# EAGLE design IDEAdapterSingle (EAGLE 6.6.0)
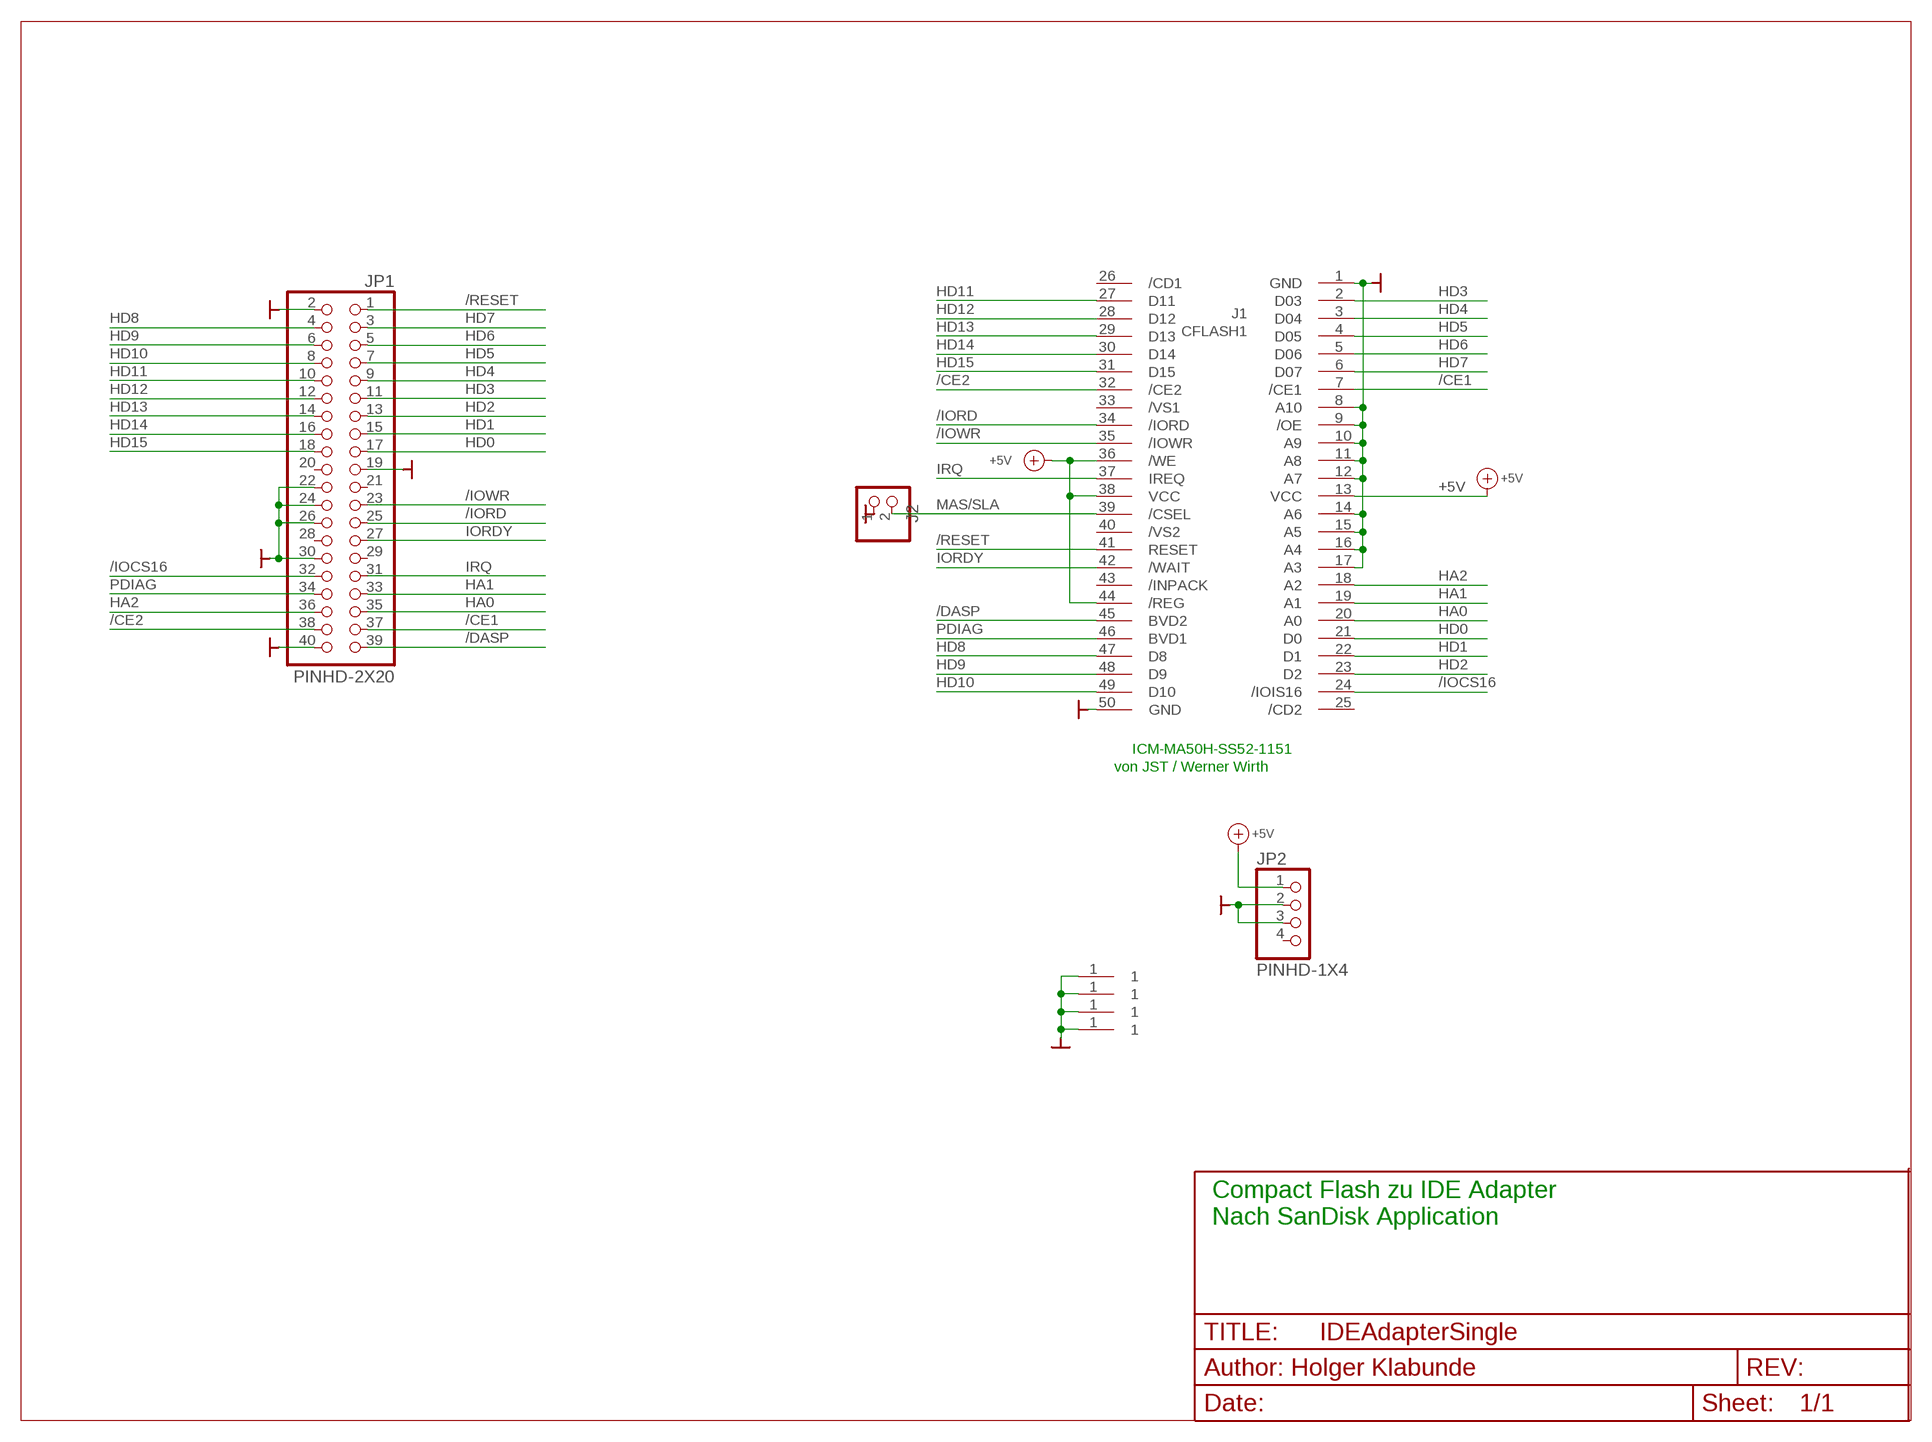
[diagram p0: schematic, sheet 1]

## Parts
J1  CFLASH1  [CFSMT]
J2  JUMPER  PINHD-1X2  [1X02]
JP1  PINHD-2X20  [2X20]
JP2  PINHD-1X4  [1X04]
U$13  BOHRUNG  [BOHRUNG]
U$14  BOHRUNG  [BOHRUNG]
U$16  BOHRUNG  [BOHRUNG]
U$17  BOHRUNG  [BOHRUNG]

## Nets
+5V: J1.13(VCC) J1.36(/WE) J1.38(VCC) J1.44(/REG) JP2.1
/CE1: J1.7(/CE1) JP1.37
/CE2: J1.32(/CE2) JP1.38
/DASP: J1.45(BVD2) JP1.39
/IOCS16: J1.24(/IOIS16) JP1.32
/IORD: J1.34(/IORD) JP1.25
/IOWR: J1.35(/IOWR) JP1.23
/RESET: J1.41(RESET) JP1.1
GND: J1.1(GND) J1.8(A10) J1.9(/OE) J1.10(A9) J1.11(A8) J1.12(A7) J1.14(A6) J1.15(A5) J1.16(A4) J1.17(A3) J1.50(GND) J2.1 JP1.2 JP1.19 JP1.22 JP1.24 JP1.26 JP1.30 JP1.40 JP2.2 JP2.3 U$13.1 U$14.1 U$16.1 U$17.1
HA0: J1.20(A0) JP1.35
HA1: J1.19(A1) JP1.33
HA2: J1.18(A2) JP1.36
HD0: J1.21(D0) JP1.17
HD1: J1.22(D1) JP1.15
HD2: J1.23(D2) JP1.13
HD3: J1.2(D03) JP1.11
HD4: J1.3(D04) JP1.9
HD5: J1.4(D05) JP1.7
HD6: J1.5(D06) JP1.5
HD7: J1.6(D07) JP1.3
HD8: J1.47(D8) JP1.4
HD9: J1.48(D9) JP1.6
HD10: J1.49(D10) JP1.8
HD11: J1.27(D11) JP1.10
HD12: J1.28(D12) JP1.12
HD13: J1.29(D13) JP1.14
HD14: J1.30(D14) JP1.16
HD15: J1.31(D15) JP1.18
IORDY: J1.42(/WAIT) JP1.27
IRQ: J1.37(IREQ) JP1.31
MAS/SLA: J1.39(/CSEL) J2.2
PDIAG: J1.46(BVD1) JP1.34
Unconnected: J1.25(/CD2) J1.26(/CD1) J1.33(/VS1) J1.40(/VS2) J1.43(/INPACK) JP1.20 JP1.21 JP1.28 JP1.29 JP2.4

## Notes on the sheet
- ICM-MA50H-SS52-1151
- von JST / Werner Wirth
- Compact Flash zu IDE Adapter
- Nach SanDisk Application

## Library data of the parts
J1 = IDEAdapterDouble:CFLASH1
J2 = pinhead:PINHD-1X2: PIN HEADER
JP1 = pinhead:PINHD-2X20: PIN HEADER
JP2 = pinhead:PINHD-1X4: PIN HEADER
U$13 U$14 U$16 U$17 = holgnorm:BOHRUNG

## Board
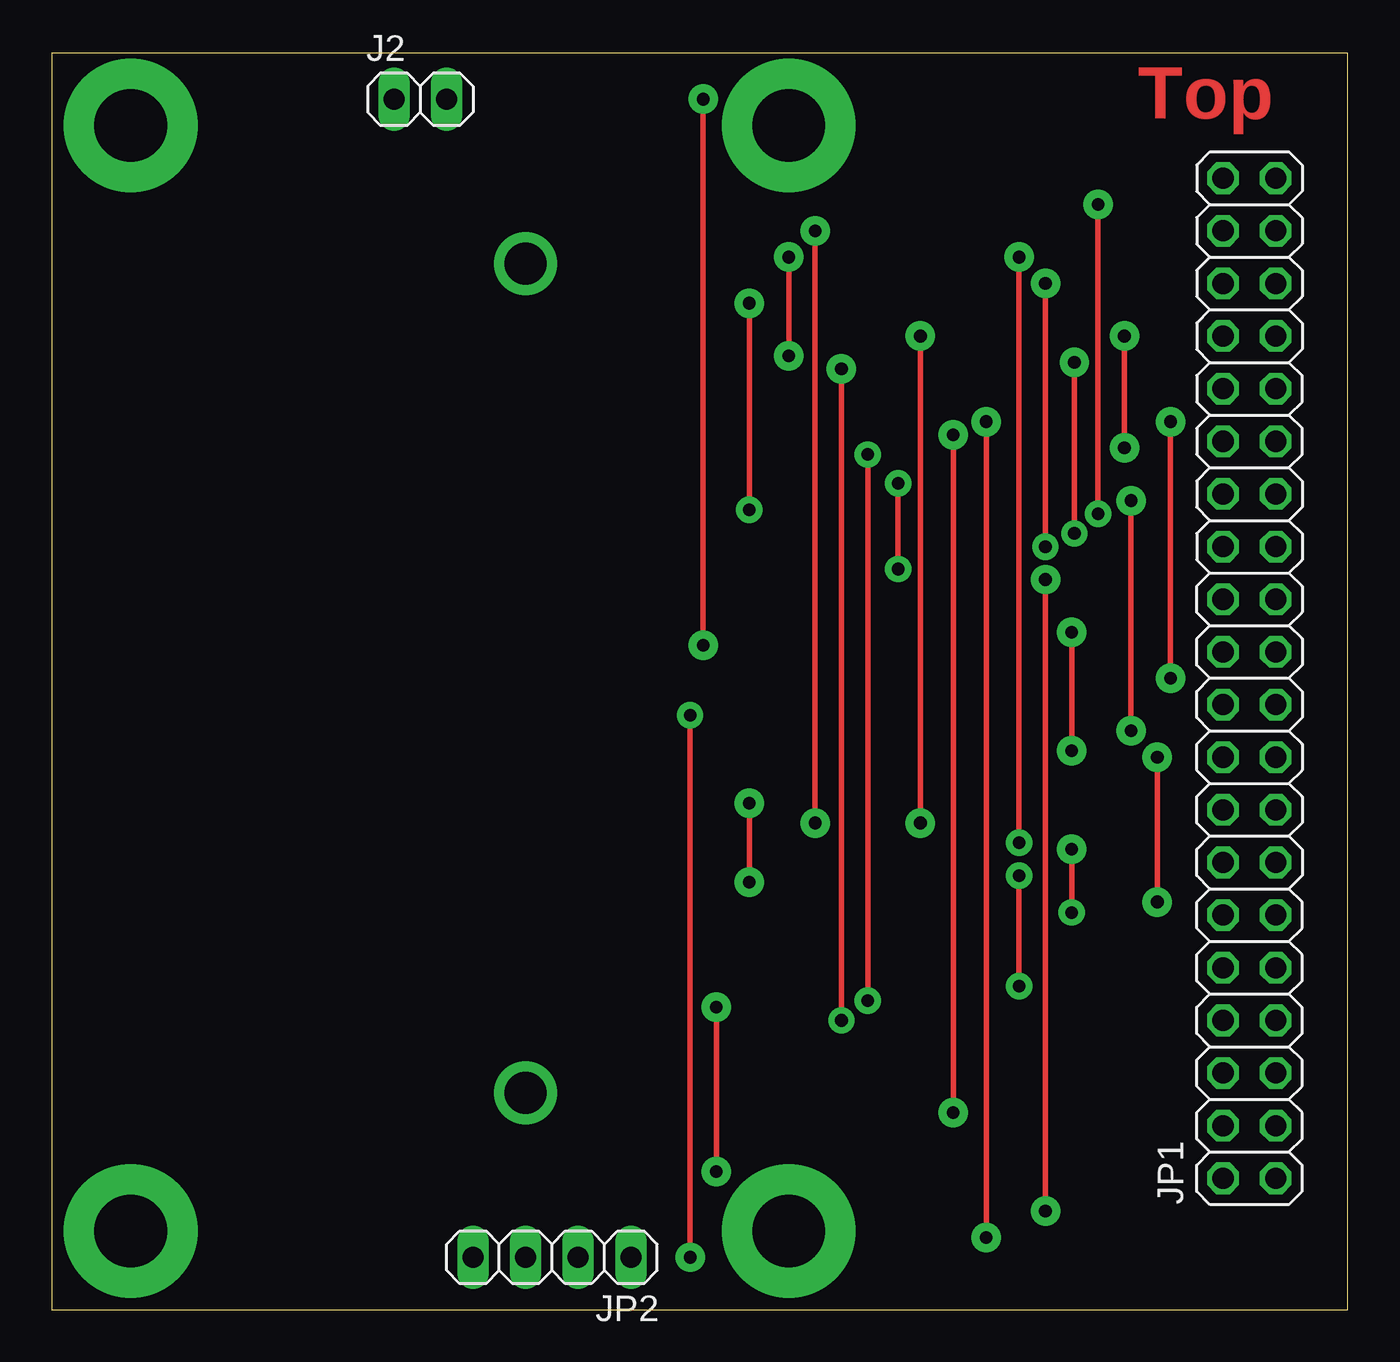
[diagram p1: board, top side]
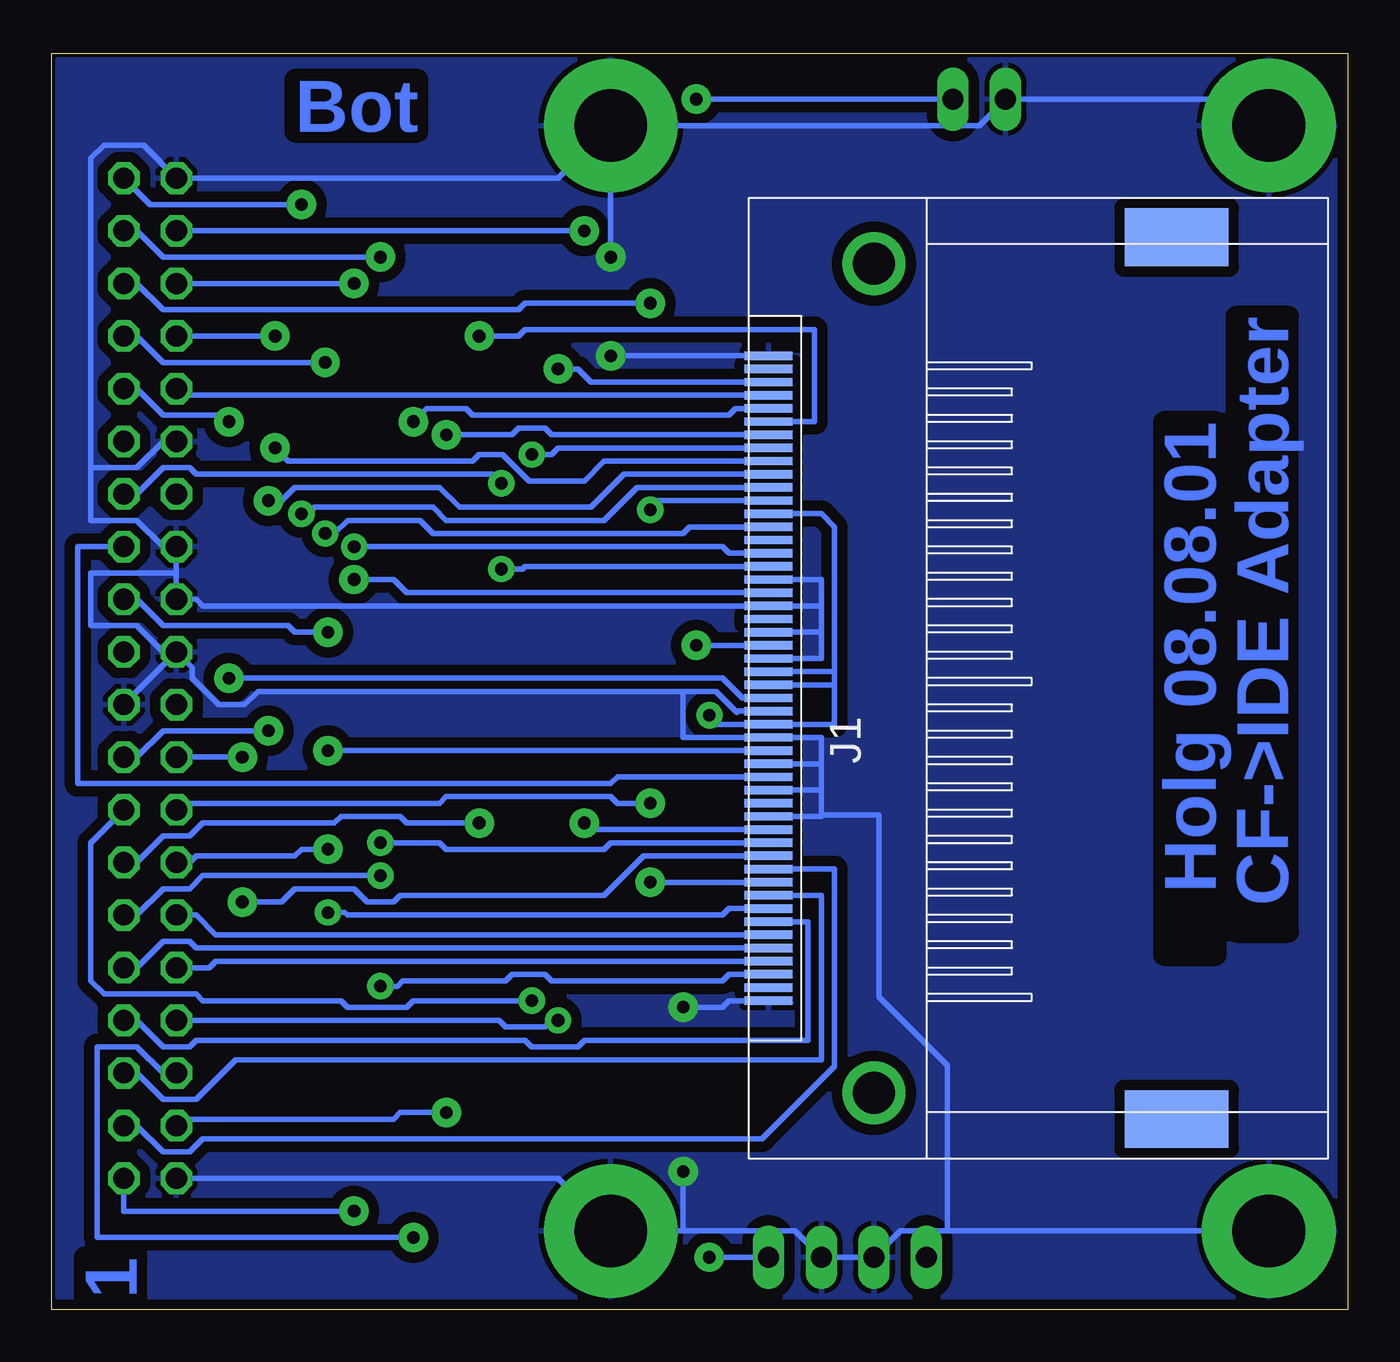
[diagram p2: board, bottom side, seen from below]

Size 62.53 x 60.63 mm. Coordinates in mm from the lower left corner, seen from the top.
Outline: 0,0 62.53,0 62.53,60.63 0,60.63 0,0
Copper layers (1*16): Top 0.035mm / dielectric 1.5mm / Bottom 0.035mm
Design rules "default *": minimum track width 10mil, minimum drill 24mil, track to track 8mil, track to pad 8mil, pad to pad 8mil, via to via 8mil, smd to smd 8mil, copper to edge 0mil, drill to drill 8mil, minimum pad ring 10mil, minimum via ring 8mil, stop-mask expansion 4mil, vias tented up to drill 0mil, thermal gap 10mil

### Footprints (pad centres in the part's own frame; a part is rotated, then mirrored left to right if it is on the bottom)
CFSMT = smd 0.406 x 2.311: 1 -15.557,0; 2 -14.287,0; 3 -13.018,0; 4 -11.748,0; 5 -10.477,0; 6 -9.207,0; 7 -7.938,0; 8 -6.668,0; 9 -5.397,0; 10 -4.128,0; 11 -2.857,0; 12 -1.587,0; 13 -0.318,0; 14 0.953,0; 15 2.223,0; 16 3.493,0; 17 4.763,0; 18 6.032,0; 19 7.303,0; 20 8.572,0; 21 9.842,0; 22 11.113,0; 23 12.383,0; 24 13.652,0; 25 14.922,0; 26 -14.922,0; 27 -13.652,0; 28 -12.383,0; 29 -11.113,0; 30 -9.842,0; 31 -8.572,0; 32 -7.303,0; 33 -6.032,0; 34 -4.763,0; 35 -3.493,0; 36 -2.223,0; 37 -0.953,0; 38 0.318,0; 39 1.587,0; 40 2.857,0; 41 4.128,0; 42 5.397,0; 43 6.668,0; 44 7.938,0; 45 9.207,0; 46 10.477,0; 47 11.748,0; 48 13.018,0; 49 14.287,0; 50 15.557,0 | drill 2.032 pad 3.048: GND@1 -20.003,-5.08; GND@2 20.003,-5.08 | smd 2.794 x 5.004: GND@3 -21.273,-19.685; GND@4 21.273,-19.685
1X02 = drill 1.016 long: 1 -1.27,0; 2 1.27,0
2X20 = drill 1.016 octagon: 1 -24.13,-1.27; 2 -24.13,1.27; 3 -21.59,-1.27; 4 -21.59,1.27; 5 -19.05,-1.27; 6 -19.05,1.27; 7 -16.51,-1.27; 8 -16.51,1.27; 9 -13.97,-1.27; 10 -13.97,1.27; 11 -11.43,-1.27; 12 -11.43,1.27; 13 -8.89,-1.27; 14 -8.89,1.27; 15 -6.35,-1.27; 16 -6.35,1.27; 17 -3.81,-1.27; 18 -3.81,1.27; 19 -1.27,-1.27; 20 -1.27,1.27; 21 1.27,-1.27; 22 1.27,1.27; 23 3.81,-1.27; 24 3.81,1.27; 25 6.35,-1.27; 26 6.35,1.27; 27 8.89,-1.27; 28 8.89,1.27; 29 11.43,-1.27; 30 11.43,1.27; 31 13.97,-1.27; 32 13.97,1.27; 33 16.51,-1.27; 34 16.51,1.27; 35 19.05,-1.27; 36 19.05,1.27; 37 21.59,-1.27; 38 21.59,1.27; 39 24.13,-1.27; 40 24.13,1.27
1X04 = drill 1.016 long: 1 -3.81,0; 2 -1.27,0; 3 1.27,0; 4 3.81,0
BOHRUNG = drill 3.505 pad 6.452: 1 0,0

### Placement (x,y rotation side)
J1  27.94,30.48 90 bottom
J2  17.78,58.42 0 top
JP1  57.78,30.48 90 top
JP2  24.13,2.54 180 top
U$13  3.81,3.81 0 top
U$14  3.81,57.15 0 top
U$16  35.56,57.15 0 top
U$17  35.56,3.81 0 top

### Tracks (layer width: path | path; a pad name or v marks a point on that pad's centre or on a via)
+5V  (via drill 0.61 pad 1.27, 0.61 pad 1.42)
  Top 0.254: v30.8,2.54 v30.8,28.7
  Bottom 0.254: 24.77,30.16 24.77,28.26 J1.36 30.48,28.26 30.48,28.32 30.8,28.64 v30.8,28.7 | 24.77,30.16 J1.13 | 24.77,30.16 24.77,30.8 | 24.77,30.8 J1.38 | 24.77,30.8 24.77,37.78 25.4,38.42 J1.44 | JP2.1 v30.8,2.54
/CE1  (via drill 0.61 pad 1.27, 0.61 pad 1.42)
  Top 0.254: v46.67,22.54 v46.67,50.8
  Bottom 0.254: v46.67,50.8 57.15,50.8 58.42,52.07 JP1.37 | J1.7 35.56,22.54 35.88,22.23 43.5,22.23 43.81,22.54 v46.67,22.54
/CE2  (via drill 0.61 pad 1.42)
  Top 0.254: v36.83,23.5 v36.83,52.07
  Bottom 0.254: v36.83,52.07 JP1.38 | v36.83,23.5 36.51,23.18 J1.32
/DASP  (via drill 0.61 pad 1.27, 0.61 pad 1.42)
  Top 0.254: v50.48,38.42 v50.48,53.34
  Bottom 0.254: v50.48,38.42 50.16,38.42 49.85,38.73 44.13,38.73 43.5,38.1 35.88,38.1 34.29,39.69 J1.45 | JP1.39 57.78,53.34 v50.48,53.34
/IOCS16
  Bottom 0.254: J1.24 55.88,44.13 56.2,44.45 JP1.32
/IORD
  Bottom 0.254: J1.34 35.24,25.72 35.56,25.4 61.28,25.4 61.28,36.83 JP1.25
/IOWR  (via drill 0.61 pad 1.42)
  Top 0.254: v49.21,26.99 v49.21,32.7
  Bottom 0.254: v49.21,32.7 50.8,32.7 51.12,33.02 57.15,33.02 58.42,34.29 JP1.23 | J1.35 v49.21,26.99
/RESET  (via drill 0.61 pad 1.42)
  Top 0.254: v47.94,4.76 v47.94,35.24
  Bottom 0.254: v47.94,35.24 46.04,35.24 45.4,34.61 J1.41 | v47.94,4.76 59.05,4.76 JP1.1
GND  (via drill 0.61 pad 1.42)
  Top 0.254: v32.07,6.67 v32.07,14.61 | v35.56,50.8 v35.56,46.04
  Bottom 0.254: JP1.2 38.1,6.35 U$17.1 32.07,3.81 | 25.4,25.08 J1.9 | 25.4,25.08 25.4,26.35 | 25.4,26.35 J1.10 | 25.4,26.35 25.4,27.62 J1.11 32.07,27.62 32.07,29.84 | v32.07,14.61 30.16,14.61 29.84,14.92 J1.1 | U$13.1 19.3,3.81 | 19.3,3.81 21.59,3.81 JP2.3 JP2.2 26.67,3.81 32.07,3.81 | 25.4,32.7 25.4,31.43 J1.14 | 25.4,32.7 J1.15 | 25.4,33.97 25.4,32.7 | 25.4,33.97 J1.16 55.24,33.97 55.56,34.29 JP1.24 | 25.4,33.97 25.4,35.24 J1.17 | JP1.22 JP1.19 | U$14.1 5.08,58.42 J2.1 17.78,57.15 U$16.1 | v35.56,46.04 J1.50 | U$16.1 38.1,54.61 JP1.40 58.1,56.2 60.01,56.2 60.64,55.56 60.64,40.64 | JP1.22 57.15,31.75 58.42,33.02 60.64,33.02 60.64,35.56 56.52,35.56 JP1.24 | JP1.24 JP1.26 57.15,36.83 58.42,38.1 60.64,38.1 60.64,40.64 | JP1.30 57.15,41.91 58.42,40.64 60.64,40.64 | 29.53,28.89 J1.12 29.46,28.89 29.46,28.83 29.53,28.89 | 29.53,28.89 30.48,29.84 32.07,29.84 | 25.4,23.88 25.4,23.81 J1.8 25.46,23.81 25.4,23.88 | 25.4,23.88 25.4,25.08 | 32.07,3.81 v32.07,6.67 | U$16.1 v35.56,50.8 | 32.07,29.84 52.58,29.84 53.21,29.21 54.48,29.21 55.75,30.48 55.75,30.99 JP1.22 | 25.4,23.88 22.61,23.88 22.61,15.11 19.3,11.81 19.3,3.81
  pour Bottom (isolate 0.508): 0.64,60.33 0.64,0.64 62.23,0.64 62.23,60.33
HA0  (via drill 0.61 pad 1.27, 0.61 pad 1.42)
  Top 0.254: v33.66,38.61 v33.66,48.58
  Bottom 0.254: v33.66,48.58 39.69,48.58 40.01,48.26 57.15,48.26 58.42,49.53 JP1.35 | J1.20 33.34,39.05 33.66,38.73 v33.66,38.61
HA1  (via drill 0.61 pad 1.27, 0.61 pad 1.42)
  Top 0.254: v49.34,37.47 v49.34,45.72
  Bottom 0.254: v49.34,45.72 57.15,45.72 58.42,46.99 JP1.33 | J1.19 31.75,37.78 32.07,37.47 44.13,37.47 44.77,38.1 48.26,38.1 48.9,37.47 v49.34,37.47
HA2  (via drill 0.61 pad 1.27, 0.61 pad 1.42)
  Top 0.254: v47.94,36.83 v47.94,49.53
  Bottom 0.254: v47.94,36.83 30.16,36.83 29.84,36.51 J1.18 | v47.94,49.53 JP1.36
HD0  (via drill 0.61 pad 1.42)
  Top 0.254: v52.07,39.05 v52.07,27.94
  Bottom 0.254: v52.07,39.05 51.44,39.05 50.8,39.69 43.81,39.69 42.86,38.73 36.51,38.73 34.92,40.32 J1.21 | v52.07,27.94 57.15,27.94 58.42,26.67 JP1.17
HD1  (via drill 0.61 pad 1.27)
  Top 0.254: v39.37,14.92 v39.37,41.27
  Bottom 0.254: v39.37,41.27 38.42,41.27 38.1,41.59 J1.22 | JP1.15 60.64,22.54 60.64,15.88 60.01,15.24 55.56,15.24 55.24,14.92 48.58,14.92 48.26,14.61 45.4,14.61 45.09,14.92 v39.37,14.92
HD2  (via drill 0.61 pad 1.42)
  Top 0.254: v41.91,23.5 v41.91,46.99
  Bottom 0.254: v41.91,46.99 40.01,46.99 39.69,47.31 25.72,47.31 25.72,42.86 J1.23 | v41.91,23.5 45.4,23.5 45.72,23.81 48.58,23.81 48.9,23.5 55.24,23.5 55.88,22.86 57.15,22.86 58.42,21.59 JP1.13
HD3  (via drill 0.61 pad 1.27)
  Top 0.254: v46.67,15.62 v46.67,20.95
  Bottom 0.254: v46.67,20.95 55.24,20.95 55.88,20.32 57.15,20.32 58.42,19.05 JP1.11 | J1.2 29.84,16.19 30.16,15.88 38.42,15.88 38.73,16.19 40.32,16.19 40.64,15.88 45.59,15.88 45.85,15.62 v46.67,15.62
HD4
  Bottom 0.254: J1.3 55.56,17.46 55.88,17.78 57.15,17.78 58.42,16.51 JP1.9
HD5
  Bottom 0.254: J1.4 26.04,18.73 26.04,13.02 36.83,13.02 37.15,12.7 39.37,12.7 39.69,13.02 55.56,13.02 55.88,12.7 57.15,12.7 58.42,13.97 JP1.7
HD6
  Bottom 0.254: J1.5 25.4,20 25.4,12.06 53.66,12.06 55.56,10.16 57.15,10.16 58.42,11.43 JP1.5
HD7
  Bottom 0.254: J1.6 24.77,21.27 24.77,11.75 28.26,8.26 55.24,8.26 55.88,7.62 57.15,7.62 58.42,8.89 JP1.3
HD8  (via drill 0.61 pad 1.42)
  Top 0.254: v43.5,9.53 v43.5,42.23
  Bottom 0.254: v43.5,42.23 40.32,42.23 40.01,42.55 38.73,42.55 38.42,42.23 J1.47 | v43.5,9.53 45.72,9.53 46.04,9.21 56.2,9.21 JP1.4
HD9  (via drill 0.61 pad 1.42)
  Top 0.254: v45.09,3.49 v45.09,42.86
  Bottom 0.254: v45.09,3.49 60.33,3.49 60.33,12.7 58.42,12.7 57.15,11.43 JP1.6 | v45.09,42.86 44.45,43.5 42.55,43.5 42.23,43.18 29.84,43.18 29.53,43.5 J1.48
HD10  (via drill 0.61 pad 1.27, 0.61 pad 1.42)
  Top 0.254: v38.1,13.97 v38.1,45.4
  Bottom 0.254: v38.1,13.97 38.42,13.97 38.73,13.65 40.64,13.65 40.96,13.97 JP1.8 | v38.1,45.4 37.15,45.4 36.51,44.77 J1.49
HD11
  Bottom 0.254: J1.27 54.61,16.83 54.93,16.51 JP1.10
HD12
  Bottom 0.254: J1.28 54.61,18.1 55.56,19.05 JP1.12
HD13  (via drill 0.61 pad 1.27, 0.61 pad 1.42)
  Top 0.254: v49.21,19.18 v49.21,22.23
  Bottom 0.254: J1.29 29.84,19.37 30.16,19.05 48.26,19.05 48.39,19.18 v49.21,19.18 | v49.21,22.23 50.48,22.23 50.8,21.91 55.56,21.91 55.88,21.59 JP1.14
HD14  (via drill 0.61 pad 1.42)
  Top 0.254: v33.66,20.64 v33.66,24.45
  Bottom 0.254: v33.66,24.45 35.24,24.45 35.56,24.77 43.5,24.77 43.81,24.45 55.88,24.45 56.2,24.13 JP1.16 | J1.30 v33.66,20.64
HD15  (via drill 0.61 pad 1.42)
  Top 0.254: v53.34,19.68 v53.34,26.67
  Bottom 0.254: v53.34,19.68 51.44,19.68 50.8,20.32 47.94,20.32 47.31,19.68 46.04,19.68 45.72,20 35.88,20 33.97,21.91 J1.31 | v53.34,26.67 JP1.18
IORDY  (via drill 0.61 pad 1.27)
  Top 0.254: v40.83,35.75 v40.83,39.88
  Bottom 0.254: JP1.27 58.42,39.37 57.15,40.64 55.88,40.64 55.56,40.32 41.27,40.32 v40.83,39.88 | v40.83,35.75 39.81,35.75 39.69,35.88 J1.42
IRQ  (via drill 0.61 pad 1.42)
  Top 0.254: v53.98,30.48 v53.98,42.86
  Bottom 0.254: v53.98,30.48 30.16,30.48 29.21,29.53 J1.37 | v53.98,42.86 54.29,43.18 57.15,43.18 58.42,44.45 JP1.31
MAS/SLA  (via drill 0.61 pad 1.42)
  Top 0.254: v31.43,32.07 v31.43,58.42
  Bottom 0.254: J1.39 v31.43,32.07 | v31.43,58.42 J2.2
PDIAG  (via drill 0.61 pad 1.42)
  Top 0.254: v51.75,41.59 v51.75,46.99
  Bottom 0.254: v51.75,41.59 51.12,40.96 42.23,40.96 41.91,41.27 40.77,41.27 39.5,40.01 36.83,40.01 35.88,40.96 J1.46 | v51.75,46.99 JP1.34

### Text on the board
Top: Top
Bottom: Bot | CF->IDE Adapter | Holg 08.08.01 | 1